# Altium schematic sheet JTAG&CONFIG.SchDoc: JTAG Chain +
size 420 x 297 mm; CheckedBy: T.Janicki; CompanyName: Creotech Instruments SA; DrawnBy: Greg Kasprowicz; Organization: CERN; Address1: European Organization for Nuclear Research; Address2: CH-1211 Geneve 23 - Switzerland; DocumentNumber: 10; Revision: -; SheetNumber: 10; SheetTotal: 15; EDA_Number: EDA-xxxx; Projet: Simple VME FMC Carrier; CreateDate: 20/11/2012; CheckedDate: 23/01/2012; Title2: FPGA Flash; DivGrp: BE-CO; Designer: G.Kasprowicz; DocumentName: jtag_chain.SchDoc; ModifiedDate: -; Rule: PcbType=ProtelPcb
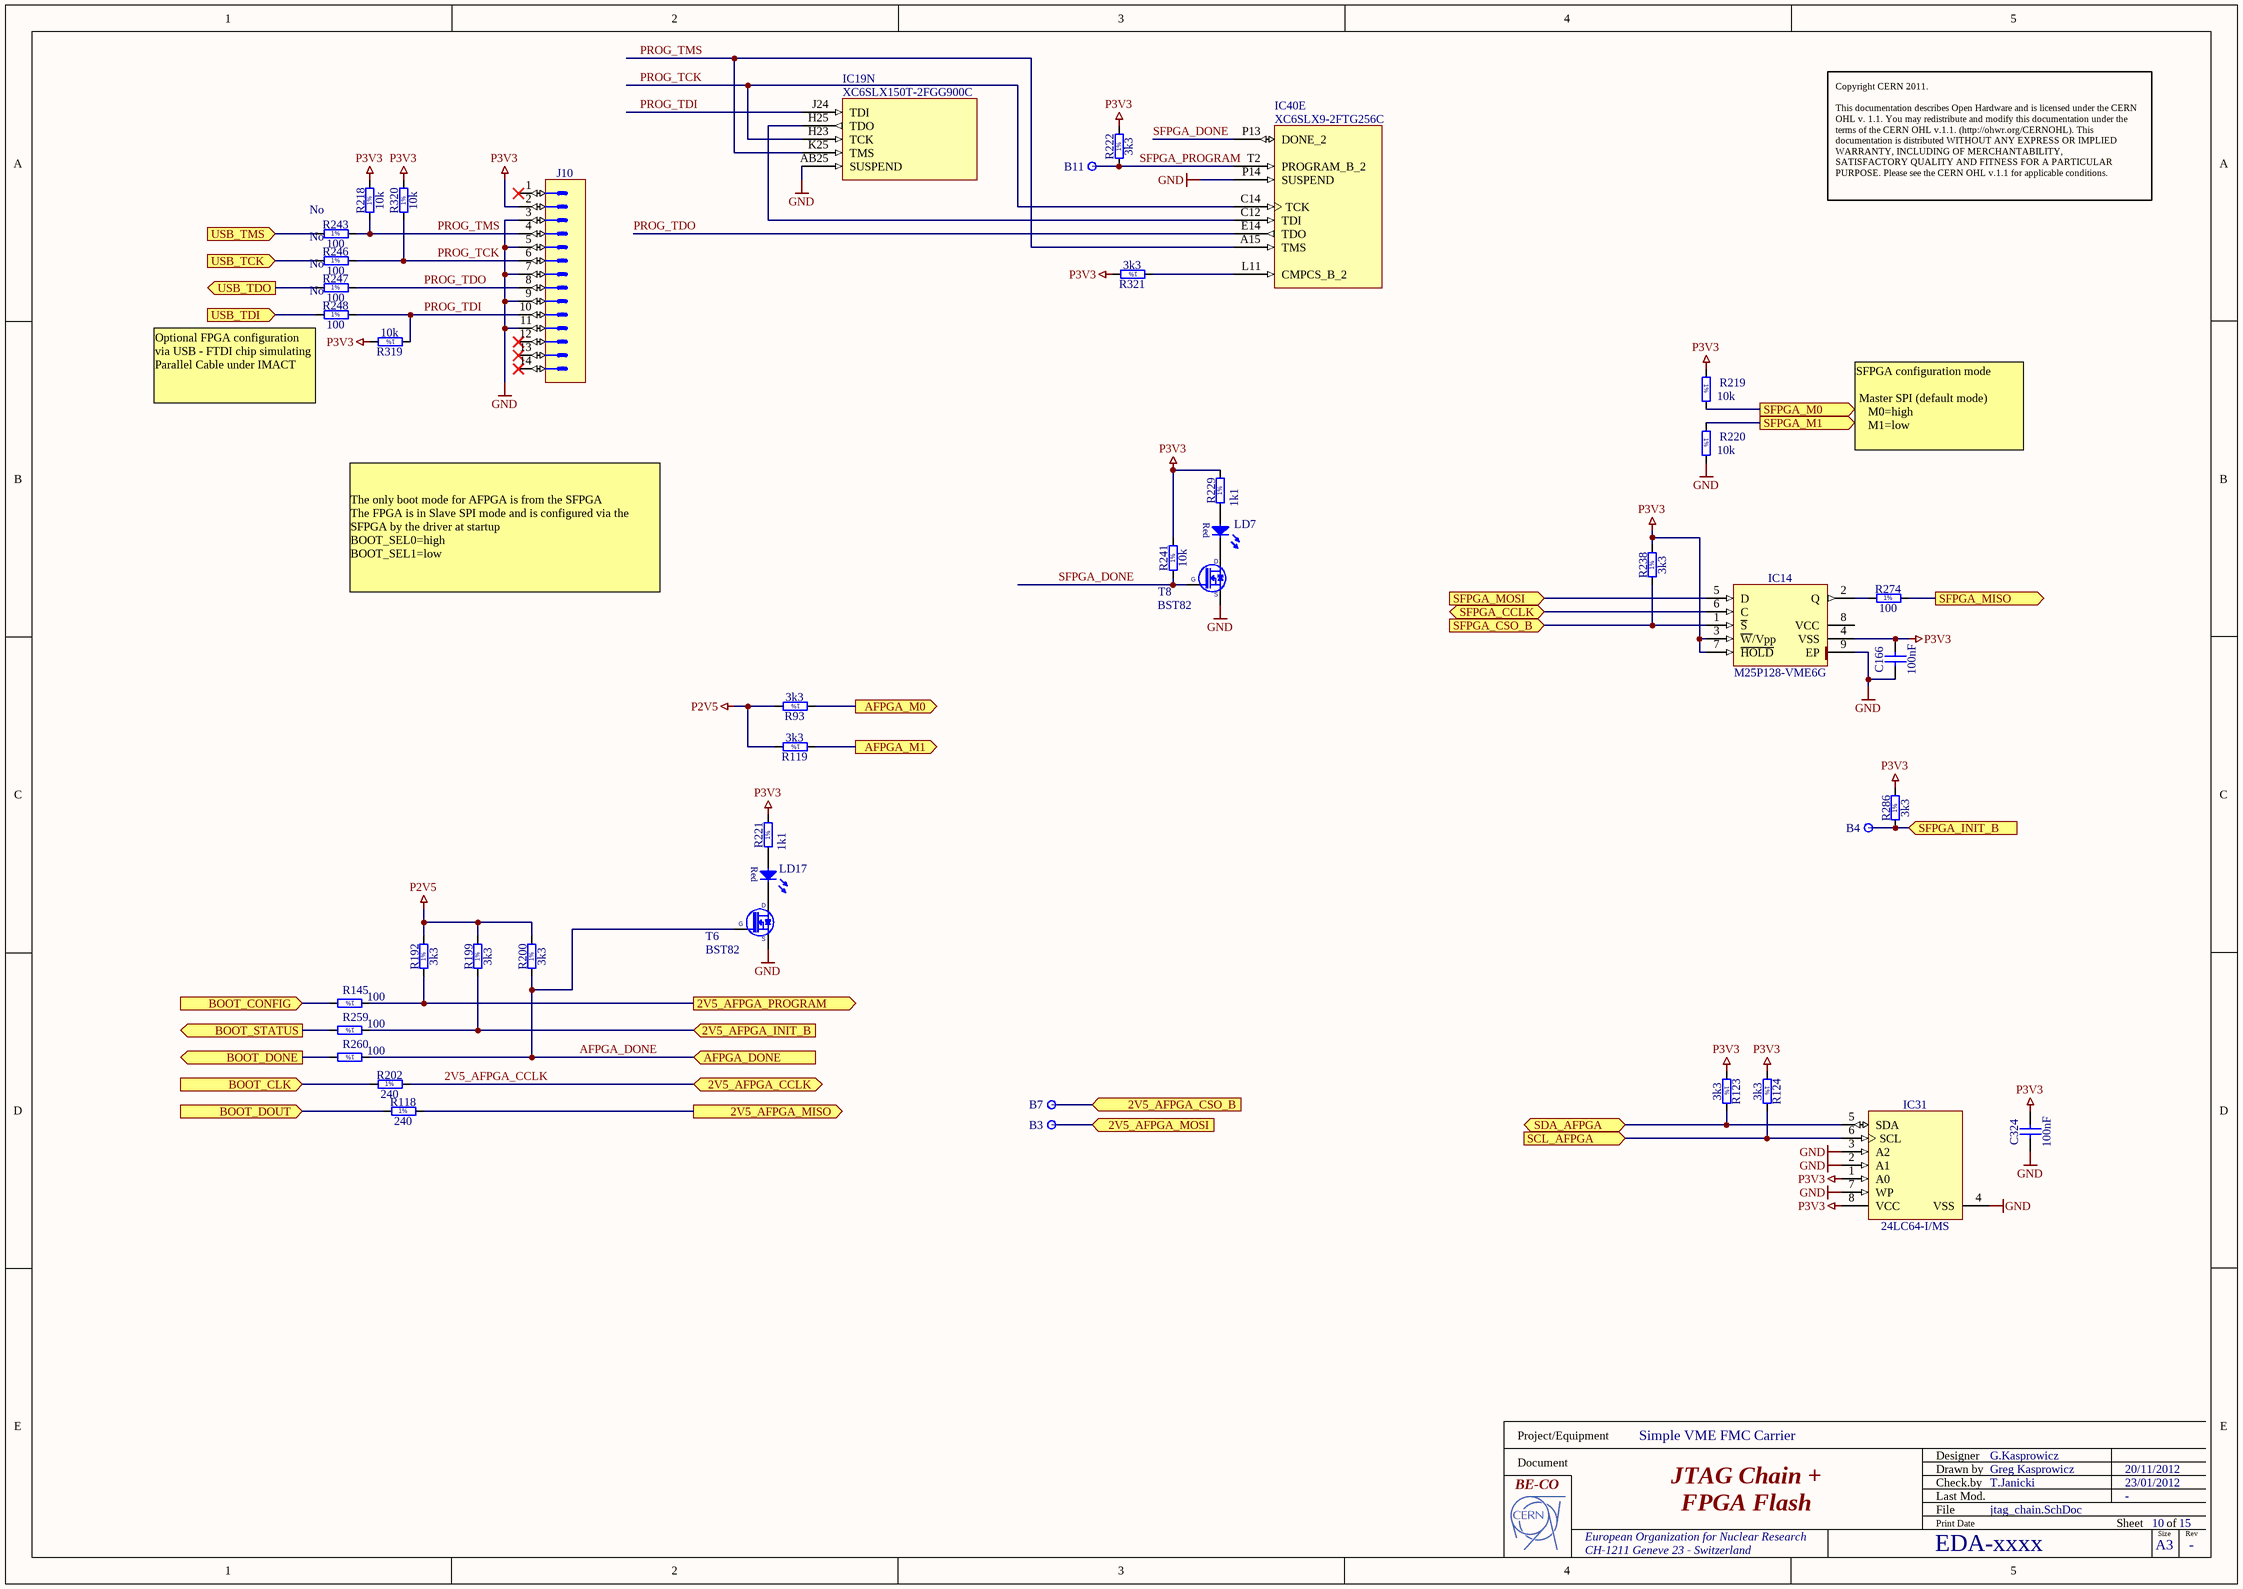
[diagram p0: JTAG&CONFIG.SchDoc]

## Parts
B3  Plated Hole  [c130h80]  (value not drawn)
B4  Plated Hole  [c130h80]  (value not drawn)
B7  Plated Hole  [c130h80]  (value not drawn)
B11  Plated Hole  [c130h80]  (value not drawn)
C166  100nF  [CAPC1005X55N]
C324  100nF  [CAPC1005X55N]
IC14  M25P128-VME6G  [PSON127P800X600X100-9N-R640X480]
IC19  XC6SLX150T-2FGG900C  [BGA900C100P30X30_3100X3100X260]  (part N of 18)
IC31  24LC64-I/MS  [SOP65P490X110-8N]
IC40  XC6SLX9-2FTG256C  [BGA256C100P16X16_1700X1700X155]  (part E of 7)
J10  Milli-Grid  [MOLEX_87832-1420]  (value not drawn)
LD7  Red  [LEDC1608X80N_RED]  (value not drawn)
LD17  Red  [LEDC1608X80N_RED]  (value not drawn)
R93  3k3  [RESC1608X55N]
R118  240  [RESC1608X55N]
R119  3k3  [RESC1608X55N]
R123  3k3  [RESC1608X55N]
R124  3k3  [RESC1608X55N]
R145  100  [RESC1608X55N]
R192  3k3  [RESC1608X55N]
R199  3k3  [RESC1608X55N]
R200  3k3  [RESC1608X55N]
R202  240  [RESC1608X55N]
R218  10k  [RESC1608X55N]
R219  10k  [RESC1608X55N]
R220  10k  [RESC1608X55N]
R221  1k1  [RESC1608X55N]
R222  3k3  [RESC1608X55N]
R229  1k1  [RESC1608X55N]
R238  3k3  [RESC1608X55N]
R241  10k  [RESC1608X55N]
R243  100  Mounted: No  [RESC1608X55N]
R246  100  Mounted: No  [RESC1608X55N]
R247  100  Mounted: No  [RESC1608X55N]
R248  100  Mounted: No  [RESC1608X55N]
R259  100  [RESC1608X55N]
R260  100  [RESC1608X55N]
R274  100  [RESC1608X55N]
R286  3k3  [RESC1608X55N]
R319  10k  [RESC1608X55N]
R320  10k  [RESC1608X55N]
R321  3k3  [RESC1608X55N]
T6  BST82  [SOT95P240X110-3N]
T8  BST82  [SOT95P240X110-3N]

## Ports
2V5_AFPGA_CCLK (bidir), 2V5_AFPGA_CSO_B (in), 2V5_AFPGA_INIT_B (in), 2V5_AFPGA_MISO (out), 2V5_AFPGA_MOSI (in), 2V5_AFPGA_PROGRAM (out), AFPGA_DONE (in), AFPGA_M0 (out), AFPGA_M1 (out), BOOT_CLK (in), BOOT_CONFIG (in), BOOT_DONE (out), BOOT_DOUT (in), BOOT_STATUS (out), SCL_AFPGA (in), SDA_AFPGA (bidir), SFPGA_CCLK (bidir), SFPGA_CSO_B (in), SFPGA_INIT_B (in), SFPGA_M0 (out), SFPGA_M1 (out), SFPGA_MISO (out), SFPGA_MOSI (in), USB_TCK (in), USB_TDI (in), USB_TDO (out), USB_TMS (in)

## Nets
GND: C166.2 C324.2 IC14.9(EP) IC19.AB25(SUSPEND) IC31.2(A1) IC31.3(A2) IC31.4(VSS) IC31.7(WP) IC40.P14(SUSPEND) J10.3 J10.5 J10.7 J10.9 J10.11 R220.2 T6.2(S) T8.2(S)
P2V5: R93.2 R119.2 R192.2 R199.2 R200.2
P3V3: C166.1 C324.1 IC14.3(~{W}/Vpp) IC14.4(VSS) IC14.7(~{HOLD}) IC31.1(A0) IC31.8(VCC) J10.2 R123.1 R124.1 R218.2 R219.1 R221.2 R222.2 R229.2 R238.2 R241.2 R286.2 R319.2 R320.2 R321.2
2V5_AFPGA_CCLK: R202.2 ; port 2V5_AFPGA_CCLK
2V5_AFPGA_CSO_B: B7.1 ; port 2V5_AFPGA_CSO_B
2V5_AFPGA_INIT_B: R199.1 R259.1 ; port 2V5_AFPGA_INIT_B
2V5_AFPGA_MISO: R118.2 ; port 2V5_AFPGA_MISO
2V5_AFPGA_MOSI: B3.1 ; port 2V5_AFPGA_MOSI
2V5_AFPGA_PROGRAM: R145.1 R192.1 ; port 2V5_AFPGA_PROGRAM
AFPGA_DONE: R200.1 R260.1 T6.1(G) ; port AFPGA_DONE
AFPGA_M0: R93.1 ; port AFPGA_M0
AFPGA_M1: R119.1 ; port AFPGA_M1
BOOT_CLK: R202.1 ; port BOOT_CLK
BOOT_CONFIG: R145.2 ; port BOOT_CONFIG
BOOT_DONE: R260.2 ; port BOOT_DONE
BOOT_DOUT: R118.1 ; port BOOT_DOUT
BOOT_STATUS: R259.2 ; port BOOT_STATUS
PROG_TCK: IC19.H23(TCK) IC40.C14(TCK) J10.6 R246.2 R320.1
PROG_TDI: IC19.J24(TDI) J10.10 R248.2 R319.1
PROG_TDO: IC40.E14(TDO) J10.8 R247.2
PROG_TMS: IC19.K25(TMS) IC40.A15(TMS) J10.4 R218.1 R243.2
SCL_AFPGA: IC31.6(SCL) R124.2 ; port SCL_AFPGA
SDA_AFPGA: IC31.5(SDA) R123.2 ; port SDA_AFPGA
SFPGA_CCLK: IC14.6(C) ; port SFPGA_CCLK
SFPGA_CSO_B: IC14.1(~{S}) R238.1 ; port SFPGA_CSO_B
SFPGA_DONE: IC40.P13(DONE_2) R241.1 T8.1(G)
SFPGA_INIT_B: B4.1 R286.1 ; port SFPGA_INIT_B
SFPGA_M0: R219.2 ; port SFPGA_M0
SFPGA_M1: R220.1 ; port SFPGA_M1
SFPGA_MISO: R274.2 ; port SFPGA_MISO
SFPGA_MOSI: IC14.5(D) ; port SFPGA_MOSI
SFPGA_PROGRAM: B11.1 IC40.T2(PROGRAM_B_2) R222.1
USB_TCK: R246.1 ; port USB_TCK
USB_TDI: R248.1 ; port USB_TDI
USB_TDO: R247.1 ; port USB_TDO
USB_TMS: R243.1 ; port USB_TMS
NetIC14_2: IC14.2(Q) R274.1
NetIC19_H25: IC19.H25(TDO) IC40.C12(TDI)
NetIC40_L11: IC40.L11(CMPCS_B_2) R321.1
NetLD7_1: LD7.1(C) T8.3(D)
NetLD7_2: LD7.2(A) R229.1
NetLD17_1: LD17.1(C) T6.3(D)
NetLD17_2: LD17.2(A) R221.1

Not connected (* = marked no-connect by the designer): IC14 8(VCC); J10 1* 12* 13* 14*

## Notes on the sheet
- Copyright CERN 2011.
  This documentation describes Open Hardware and is licensed under the CERN OHL v. 1.1. You may redistribute and modify this documentation under the terms of the CERN OHL v.1.1. (http://ohwr.org/CERNOHL). This documentation is distributed WITHOUT ANY EXPRESS OR IMPLIED WARRANTY, INCLUDING OF MERCHANTABILITY, SATISFACTORY QUALITY AND FITNESS FOR A PARTICULAR PURPOSE. Please see the CERN OHL v.1.1 for applicable conditions.
- (near R248) Optional FPGA configuration via USB - FTDI chip simulating Parallel Cable under IMACT
- SFPGA configuration mode
  Master SPI (default mode)
  M0=high
  M1=low
- The only boot mode for AFPGA is from the SFPGA
  The FPGA is in Slave SPI mode and is configured via the SFPGA by the driver at startup
  BOOT_SEL0=high
  BOOT_SEL1=low
- Project/Equipment
- Document
- Designer
- Drawn by
- Check.by
- File
- Last Mod.
- Print Date
- Sheet
- Size
- A3
- of
- Rev
- (in symbol R0603_1K1_1%_0.1W_100PPM) 1%
- (in symbol R0603_3K3_1%_0.1W_100PPM) 1%
- (in symbol R0603_10K_1%_0.1W_100PPM) 1%
- (in symbol R0603_100R_1%_0.1W_100PPM) 1%
- (in symbol R0603_240R_1%_0.1W_100PPM) 1%

## Library data of the parts
B3 B4 B7 B11 = PLATED_HOLE0.8_PAD1.3: Single Terminal Socket; Part Description: Plated Through Hole: Hole Dia.=0.8mm Pad Dia.=1.3mm; Mounted: No; Table: Pads; Part Number: PLATED_HOLE0.8_PAD1.3; Component Kind: Standard (No BOM); Component Type: Standard (No BOM); Pin Count: 1; Family: Plated Hole; Socket: No; SMD: No; Status: None; ComponentHeight: 0mm; Author: CERN DEM JLC; CreateDate: 2008-10-30; LatestRevisionDate: 2008-10-30; PackageDescription: Plated Through Hole: Hole Dia.=0.8mm Pad Dia.=1.3mm
C166 C324 = CC0402_100NF_16V_10%_X7R: Non-polarised capacitor; Part Description: SMD Multilayer Chip Ceramic Capacitor; Manufacturer: GENERIC; Manufacturer1 Part Number: 223878715649; Voltage: 16V; TC: X7R; Tolerance: ±10%; Table: Capacitors SMD; Part Number: CC0402_100NF_16V_10%_X7R; Component Kind: Standard; Component Type: Standard; Pin Count: 2; Value: 100nF; Status: Not Recommended; Manufacturer Part Number: CC0402_100NF_16V_10%_X7R; Case: 0402; Mounted: Yes; Socket: No; SMD: Yes; Manufacturer1 Example: PHYCOMP; Manufacturer1 ComponentHeight: 0.55mm; HelpURL: \\cern.ch\dfs\Applications\Altium\Datasheets\CC0402_X7R_PHYCOMP.pdf; Author: CERN DEM JLC; CreateDate: 12/3/2007; LatestRevisionDate: 12/3/2007
IC14 = M25P128-VME6G: 128 Mbit (Multilevel), low-voltage, Serial Flash memory with 50-MHz SPI bus interface; Manufacturer: NUMONYX; Table: Logic; Part Number: M25P128-VME6G; Component Kind: Standard; Component Type: Standard; Device: M25P128-VME6G; PackageDescription: SON,1.27mm,pitch; 8 pin,8.00mm W X 6.00mm L X 1.00mm H body (w/pullback leads,thermal tab 6.4 X 4.8mm), IPC Medium Density; Part Description: 128 Mbit (Multilevel), Low-Voltage, Serial Flash Memory With 50-MHz SPI Bus Interface; Manufacturer Part Number: M25P128-VME6G; Pin Count: 9; Case: SON8; Mounted: Yes; Socket: No; SMD: Yes; ComponentHeight: 1mm; HelpURL: \\cern.ch\dfs\Applications\Altium\Datasheets\M25P128-VME6G.pdf; Author: CERN DEM JLC; CreateDate: 2010-01-20; LatestRevisionDate: 2010-01-20
IC19 = XC6SLX150T-2FGG900C: SPARTAN-6, FPGA, 900-Ball BGA, Commercial Grade, Pb-Free; Part Description: SPARTAN-6, FPGA, 540 User I/Os, 8 GTPs, 900-Ball BGA, Commercial Grade, Pb-Free; Manufacturer: XILINX; Table: Logic; Part Number: XC6SLX150T-2FGG900C; Component Kind: Standard; Component Type: Standard; Device: XC6SLX150T-2FGG900C; PackageDescription: BGA,1.00mm pitch, square; 900 pin, 30 columns X 30 rows, 31.00mm X 31.00mm X 2.60mm H, IPC Medium Density; Manufacturer Part Number: XC6SLX150T-2FGG900C; Pin Count: 900; Case: BGA900; Mounted: Yes; Socket: No; SMD: Yes; ComponentHeight: 2.6mm; HelpURL: \\cern.ch\dfs\Applications\Altium\Datasheets\XC6SLX150T-2FGG900C.pdf; ComponentLink1URL: \\cern.ch\dfs\Applications\Altium\Datasheets\XC6SLX150T-2FGG900C_Package-Pinouts.pdf; ComponentLink1Description: Package/Pinouts; Author: CERN DEM JLC; CreateDate: 2009-11-17; LatestRevisionDate: 2009-11-17
IC31 = 24LC64-I/MS: 64K I2C Serial EEPROM; Part Description: 2.5V-5.5V, 64K (8K x 8-bit) I2C Serial EEPROM; Manufacturer: MICROCHIP TECHNOLOGY; Table: Logic; Part Number: 24LC64-I/MS; Component Kind: Standard; Component Type: Standard; Device: 24LC64-I/MS; PackageDescription: SOP, 0.65mm pitch; 8 pin, 3.00mm W X 3.00mm L X 1.10mm H body, IPC Medium Density; Manufacturer Part Number: 24LC64-I/MS; Pin Count: 8; Case: MSOP8; Mounted: Yes; Socket: No; SMD: Yes; ComponentHeight: 1.1mm; HelpURL: \\cern.ch\dfs\Applications\Altium\Datasheets\24LC64-I-MS.pdf; Author: CERN DEM JLC; CreateDate: 2011-01-24; LatestRevisionDate: 2011-01-24
IC40 = XC6SLX9-2FTG256C: Spartan-6 LX 1.2V FPGA, 186 User I/Os, 256-Ball Fine-Pitch Thin BGA (1.0mm Pitch), Speed Grade 2, Commercial Grade, Pb-Free; Manufacturer: XILINX; Table: Logic; Part Number: XC6SLX9-2FTG256C; Component Kind: Standard; Component Type: Standard; Device: XC6SLX9-2FTG256C; PackageDescription: BGA 1mm, Pitch, Square 256 Pin, 16 Columns x 16 Rows, Body 17mm X 17mm X 1.55mm H; Part Description: Spartan-6 LX 1.2V FPGA, 186 User I/Os, 256-Ball Fine-Pitch Thin BGA (1.0mm Pitch), Speed Grade 2, Commercial Grade, Pb-Free; Manufacturer Part Number: XC6SLX9-2FTG256C; Pin Count: 256; Case: BGA256; Mounted: Yes; Socket: No; SMD: Yes; ComponentHeight: 1.55mm; HelpURL: \\cern.ch\dfs\Applications\Altium\Datasheets\XC6SLX9-2FTG256C.pdf; ComponentLink1URL: \\cern.ch\dfs\Applications\Altium\Datasheets\XC6SLX9-2FTG256C_Package-Pinout.pdf; ComponentLink1Description: Package/Pinouts; Author: CERN DEM JLC; CreateDate: 2011-11-01; LatestRevisionDate: 2011-11-01
J10 = MOLEX_87832-1420: Connector 14 Male; Part Description: 2.00mm (.079") Pitch Milli-Grid™ Header, Surface Mount, Vertical, Shrouded, 14 Circuits,with Locking Windows and Centre Polarization Slot, PCB Locator; Manufacturer: MOLEX; Part Number: MOLEX_87832-1420; Component Kind: Standard; Component Type: Standard; Pin Count: 14; Family: Milli-Grid; Mounted: Yes; Socket: No; SMD: Yes; Manufacturer Part Number: 87832-1420; ComponentHeight: 6.4mm; HelpURL: \\cern.ch\dfs\Applications\Altium\Datasheets\MOLEX_87832-1420.pdf; Author: CERN DEM JLC; CreateDate: 9/9/2008; LatestRevisionDate: 9/9/2008; Table: MOLEX
LD7 LD17 = LED_ROHM_SML-311UTT86K: LED Red 1C 2A; Part Description: Low current chip LED SML-311 Serie; Manufacturer: ROHM; Table: LEDs & Displays; Part Number: LED_ROHM_SML-311UTT86K; Component Kind: Standard; Component Type: Standard; Color: Red; PackageDescription: Chip RED LED, 2-Leads, Body 1.6x0.8mm, IPC Medium Density; Manufacturer Part Number: SML-311UTT86K; Pin Count: 2; Mounted: Yes; Socket: No; SMD: Yes; ComponentHeight: 0.8mm; HelpURL: \\cern.ch\dfs\Applications\Altium\Datasheets\LED_ROHM_SML-311UTT86K.pdf; Author: CERN DEM JLC; CreateDate: 3/16/2010; LatestRevisionDate: 3/17/2010
R93 R119 R123 R124 R192 R199 R200 R222 R238 R286 R321 = R0603_3K3_1%_0.1W_100PPM: Resistor - 1%; Part Description: General Purpose Thick Film Chip Resistor; Manufacturer: GENERIC; Manufacturer1 Part Number: NRC06F3301TRF; Power: 0.1W; TC: ±100ppm/°C; Table: Resistors SMD; Part Number: R0603_3K3_1%_0.1W_100PPM; Component Kind: Standard; Component Type: Standard; Pin Count: 2; Value: 3k3; Status: Preferred; Tolerance: ±1%; Manufacturer Part Number: R0603_3K3_1%_0.1W_100PPM; Case: 0603; Mounted: Yes; Socket: No; SMD: Yes; Manufacturer1 Example: NIC COMPONENT; Manufacturer1 ComponentHeight: 0.55mm; HelpURL: \\cern.ch\dfs\Applications\Altium\Datasheets\R0603_NIC_NRC.pdf; Author: CERN DEM JLC; CreateDate: 12/3/2007; LatestRevisionDate: 3/13/2008
R118 R202 = R0603_240R_1%_0.1W_100PPM: Resistor - 1%; Part Description: General Purpose Thick Film Chip Resistor; Manufacturer: GENERIC; Manufacturer1 Part Number: NRC06F2400TRF; Power: 0.1W; TC: ±100ppm/°C; Table: Resistors SMD; Part Number: R0603_240R_1%_0.1W_100PPM; Component Kind: Standard; Component Type: Standard; Pin Count: 2; Value: 240; Status: Preferred; Tolerance: ±1%; Manufacturer Part Number: R0603_240R_1%_0.1W_100PPM; Case: 0603; Mounted: Yes; Socket: No; SMD: Yes; Manufacturer1 Example: NIC COMPONENT; Manufacturer1 ComponentHeight: 0.55mm; HelpURL: \\cern.ch\dfs\Applications\Altium\Datasheets\R0603_NIC_NRC.pdf; Author: CERN DEM JLC; CreateDate: 12/3/2007; LatestRevisionDate: 3/13/2008
R145 R243 R246-R248 R259 R260 R274 = R0603_100R_1%_0.1W_100PPM: Resistor - 1%; Part Description: General Purpose Thick Film Chip Resistor; Manufacturer: GENERIC; Manufacturer1 Part Number: NRC06F4700TRF; Power: 0.1W; TC: ±100ppm/°C; Table: Resistors SMD; Part Number: R0603_100R_1%_0.1W_100PPM; Component Kind: Standard; Component Type: Standard; Pin Count: 2; Value: 100; Status: Preferred; Tolerance: ±1%; Manufacturer Part Number: R0603_100R_1%_0.1W_100PPM; Case: 0603; Socket: No; SMD: Yes; Manufacturer1 Example: NIC COMPONENT; Manufacturer1 ComponentHeight: 0.55mm; HelpURL: \\cern.ch\dfs\Applications\Altium\Datasheets\R0603_NIC_NRC.pdf; Author: CERN DEM JLC; CreateDate: 2007-12-03; LatestRevisionDate: 2008-03-13
  R145 R259 R260 R274: Mounted: Yes
R218-R220 R241 R319 R320 = R0603_10K_1%_0.1W_100PPM: Resistor - 1%; Part Description: General Purpose Thick Film Chip Resistor; Manufacturer: GENERIC; Manufacturer1 Part Number: NRC06F1002TRF; Power: 0.1W; TC: ±100ppm/°C; Table: Resistors SMD; Part Number: R0603_10K_1%_0.1W_100PPM; Component Kind: Standard; Component Type: Standard; Pin Count: 2; Value: 10k; Status: Preferred; Tolerance: ±1%; Manufacturer Part Number: R0603_10K_1%_0.1W_100PPM; Case: 0603; Mounted: Yes; Socket: No; SMD: Yes; Manufacturer1 Example: NIC COMPONENT; Manufacturer1 ComponentHeight: 0.55mm; HelpURL: \\cern.ch\dfs\Applications\Altium\Datasheets\R0603_NIC_NRC.pdf; Author: CERN DEM JLC
  R218 R241 R319 R320: CreateDate: 2007-12-03; LatestRevisionDate: 2008-03-13
  R219 R220: CreateDate: 12/3/2007; LatestRevisionDate: 3/13/2008
R221 R229 = R0603_1K1_1%_0.1W_100PPM: Resistor - 1%; Part Description: General Purpose Thick Film Chip Resistor; Manufacturer: GENERIC; Manufacturer1 Part Number: NRC06F1101TRF; Power: 0.1W; TC: ±100ppm/°C; Table: Resistors SMD; Part Number: R0603_1K1_1%_0.1W_100PPM; Component Kind: Standard; Component Type: Standard; Pin Count: 2; Value: 1k1; Status: Preferred; Tolerance: ±1%; Manufacturer Part Number: R0603_1K1_1%_0.1W_100PPM; Case: 0603; Mounted: Yes; Socket: No; SMD: Yes; Manufacturer1 Example: NIC COMPONENT; Manufacturer1 ComponentHeight: 0.55mm; HelpURL: \\cern.ch\dfs\Applications\Altium\Datasheets\R0603_NIC_NRC.pdf; Author: CERN DEM JLC; CreateDate: 2007-12-03; LatestRevisionDate: 2008-03-13
T6 T8 = BST82: N-CHANNEL MOSFET WITH DIODE; Part Description: 100V 190mA N-Channel Enhancement Mode Field-Effect Transistor; Manufacturer: NXP SEMICONDUCTORS; Table: Transistors; Part Number: BST82; Component Kind: Standard; Component Type: Standard; Device: BST82; PackageDescription: SOT23 3-Leads, Pitch 0.95mm - Body 1.4x3mm, IPC Medium Density; Manufacturer Part Number: BST82; Pin Count: 3; Case: SOT23-3; Mounted: Yes; Socket: No; SMD: Yes; ComponentHeight: 1.1mm; HelpURL: \\cern.ch\dfs\Applications\Altium\Datasheets\BST82.pdf; Author: CERN DEM JLC; CreateDate: 5/14/2008; LatestRevisionDate: 5/14/2008